# EAGLE design mh (EAGLE 7.4.0)
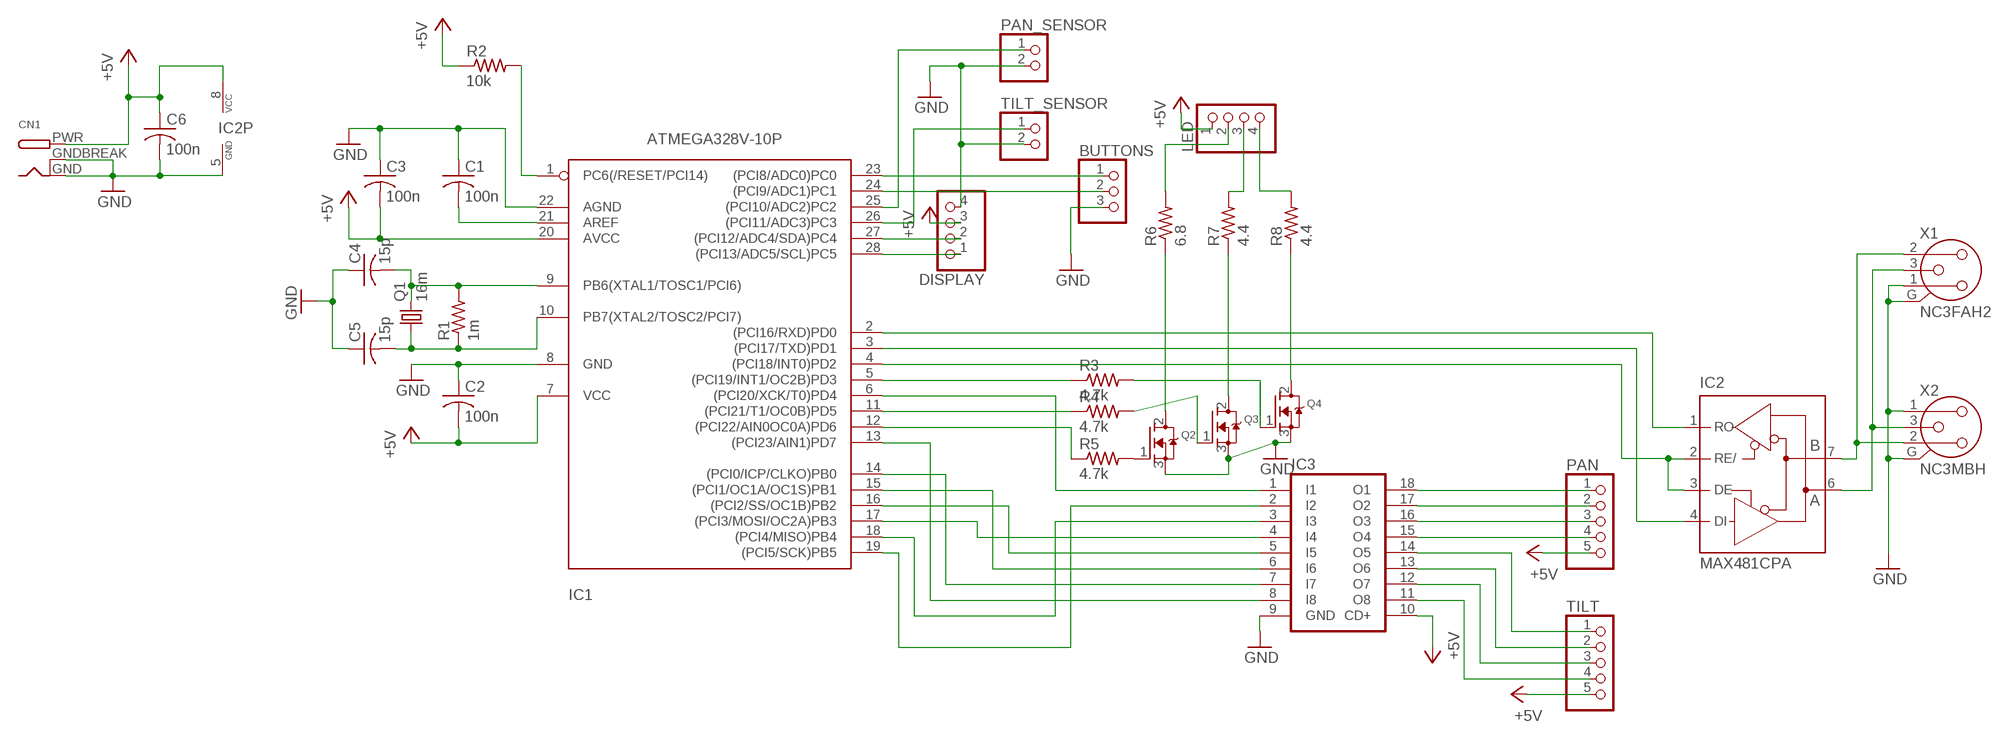
[diagram p0: schematic, sheet 1]

## Parts
BUTTONS  PINHD-1X3  [1X03]
C1  100n  C-US025-024X044  [C025-024X044]
C2  100n  C-US025-024X044  [C025-024X044]
C3  100n  C-US025-024X044  [C025-024X044]
C4  15p  C-US050-024X044  [C050-024X044]
C5  15p  C-US050-024X044  [C050-024X044]
C6  100n  C-US025-024X044  [C025-024X044]
CN1  DCBARRELPTH  [DCJACK_2MM_PTH]
DISPLAY  PINHD-1X4  [1X04]
IC1  ATMEGA328V-10P  [DIL28-3]
IC2  MAX481CPA  [DIL08]
IC3  ULN2803A  [DIL18]
LED  PINHD-1X4  [1X04]
PAN  PINHD-1X5  [1X05]
PAN_SENSOR  PINHD-1X2  [1X02]
Q1  16m  CRYSTALHC49S  [HC49/S]
Q2  MOSFET-NGDS_TO220V  [TO220V]
Q3  MOSFET-NGDS_TO220V  [TO220V]
Q4  MOSFET-NGDS_TO220V  [TO220V]
R1  1m  R-US_0207/10  [0207/10]
R2  10k  R-US_0207/10  [0207/10]
R3  4.7k  R-US_0207/10  [0207/10]
R4  4.7k  R-US_0207/10  [0207/10]
R5  4.7k  R-US_0207/10  [0207/10]
R6  6.8  R-US_0617/17  [0617/17]
R7  4.4  R-US_0617/17  [0617/17]
R8  4.4  R-US_0617/17  [0617/17]
TILT  PINHD-1X5  [1X05]
TILT_SENSOR  PINHD-1X2  [1X02]
X1  NC3FAH2  [NC3FAH2]
X2  NC3MBH  [NC3MBH]

## Nets
+5V: C2.2 C3.2 C6.1 CN1.PWR DISPLAY.3 IC1.7(VCC) IC1.20(AVCC) IC2.8(VCC) IC3.10(CD+) LED.1 PAN.5 R2.1 TILT.5
GND: BUTTONS.3 C1.1 C2.1 C3.1 C4.1 C5.1 C6.2 CN1.GND CN1.GNDBREAK DISPLAY.4 IC1.8(GND) IC1.22(AGND) IC2.5(GND) IC3.9(GND) PAN_SENSOR.2 Q2.3(S) Q3.3(S) Q4.3(S) TILT_SENSOR.2 X1.1 X1.G X2.1 X2.G
N$1: IC1.14((PCI0/ICP/CLKO)PB0) IC3.7(I7)
N$2: C5.2 IC1.10(PB7(XTAL2/TOSC2/PCI7)) Q1.1 R1.1
N$3: C1.2 IC1.21(AREF)
N$4: IC1.5((PCI19/INT1/OC2B)PD3) R3.1
N$5: IC1.1(PC6(/RESET/PCI14)) R2.2
N$6: IC1.11((PCI21/T1/OC0B)PD5) R4.1
N$7: IC1.12((PCI22/AIN0OC0A)PD6) R5.1
N$8: Q2.1(G) R5.2
N$9: Q3.1(G) R4.2
N$10: Q4.1(G) R3.2
N$11: Q2.2(D) R6.1
N$12: Q3.2(D) R7.1
N$14: LED.4 R8.2
N$15: LED.3 R7.2
N$16: LED.2 R6.2
N$18: IC1.19((PCI5/SCK)PB5) IC3.2(I2)
N$19: IC1.18((PCI4/MISO)PB4) IC3.3(I3)
N$20: IC1.17((PCI3/MOSI/OC2A)PB3) IC3.4(I4)
N$21: IC1.16((PCI2/SS/OC1B)PB2) IC3.5(I5)
N$22: IC1.15((PCI1/OC1A/OC1S)PB1) IC3.6(I6)
N$23: IC1.6((PCI20/XCK/T0)PD4) IC3.1(I1)
N$24: IC1.13((PCI23/AIN1)PD7) IC3.8(I8)
N$25: IC3.18(O1) PAN.1
N$26: IC3.17(O2) PAN.2
N$27: IC3.16(O3) PAN.3
N$28: IC3.15(O4) PAN.4
N$29: IC3.14(O5) TILT.1
N$30: IC3.13(O6) TILT.2
N$31: IC1.4((PCI18/INT0)PD2) IC2.2(RE/) IC2.3(DE)
N$32: IC3.12(O7) TILT.3
N$33: IC1.3((PCI17/TXD)PD1) IC2.4(DI)
N$34: IC3.11(O8) TILT.4
N$35: DISPLAY.1 IC1.28((PCI13/ADC5/SCL)PC5)
N$36: DISPLAY.2 IC1.27((PCI12/ADC4/SDA)PC4)
N$37: IC1.2((PCI16/RXD)PD0) IC2.1(RO)
N$38: IC1.25((PCI10/ADC2)PC2) PAN_SENSOR.1
N$39: IC1.26((PCI11/ADC3)PC3) TILT_SENSOR.1
N$40: C4.2 IC1.9(PB6(XTAL1/TOSC1/PCI6)) Q1.2 R1.2
N$41: BUTTONS.1 IC1.23((PCI8/ADC0)PC0)
N$42: IC2.7(B) X1.2 X2.2
N$43: BUTTONS.2 IC1.24((PCI9/ADC1)PC1)
N$44: IC2.6(A) X1.3 X2.3
N$45: Q4.2(D) R8.1

## Library data of the parts
BUTTONS = pinhead:PINHD-1X3: PIN HEADER
C1-C6 = adafruit:C-US: CAPACITOR, American symbol
CN1 = adafruit:DCBARREL: 2.0mm DC Barrel Jack DCJACK_2MM_PTH - Through Hole Jack (4UConnector: 05537)
DISPLAY LED = pinhead:PINHD-1X4: PIN HEADER
IC1 = atmega328:ATMEGA328*P: MICROCONTROLLER 32 kBytes FLASH 2 kBytes SRAM 1 kBytes EEPROM USART 8-channel 10 bit ADC
IC2 = maxim:MAX481CPA: RS485 TRANSEIVER; MPN: MAX481CPA+; OC_FARNELL: unknown; OC_NEWARK: 99K3445
IC3 = uln-udn:ULN2803A: DRIVER ARRAY
PAN TILT = pinhead:PINHD-1X5: PIN HEADER
PAN_SENSOR TILT_SENSOR = pinhead:PINHD-1X2: PIN HEADER
Q1 = adafruit:CRYSTAL: CRYSTAL; OC_FARNELL: 1667008; OC_NEWARK: unknown
Q2-Q4 = adafruit:MOSFET-N: N-Channel Mosfet 2N7002E - 60V 260mA SOT23 [Digikey: 2N7002ET1GOSTR-ND] - REEL BSH103 - 30V 850mA SOT23 [Digikey: 568-5013-1-ND]
R1-R8 = adafruit:R-US_: RESISTOR, American symbol
X1 = con-neutrik_ag:NC3: Neutrik Audio Connector XLR SERIES Stereo 1/4" jack Source: www.neutrik.com/; MPN: NC3FAH2; OC_FARNELL: unknown; OC_NEWARK: 27B4208
X2 = con-neutrik_ag:NC3: Neutrik Audio Connector XLR SERIES Stereo 1/4" jack Source: www.neutrik.com/; MF: NEUTRIK; MPN: NC3MBH; OC_FARNELL: unknown; OC_NEWARK: 91F3470

## Net classes
0 default: width 0.381 mm, drill 0.508 mm, clearance 0.381 mm

## Board
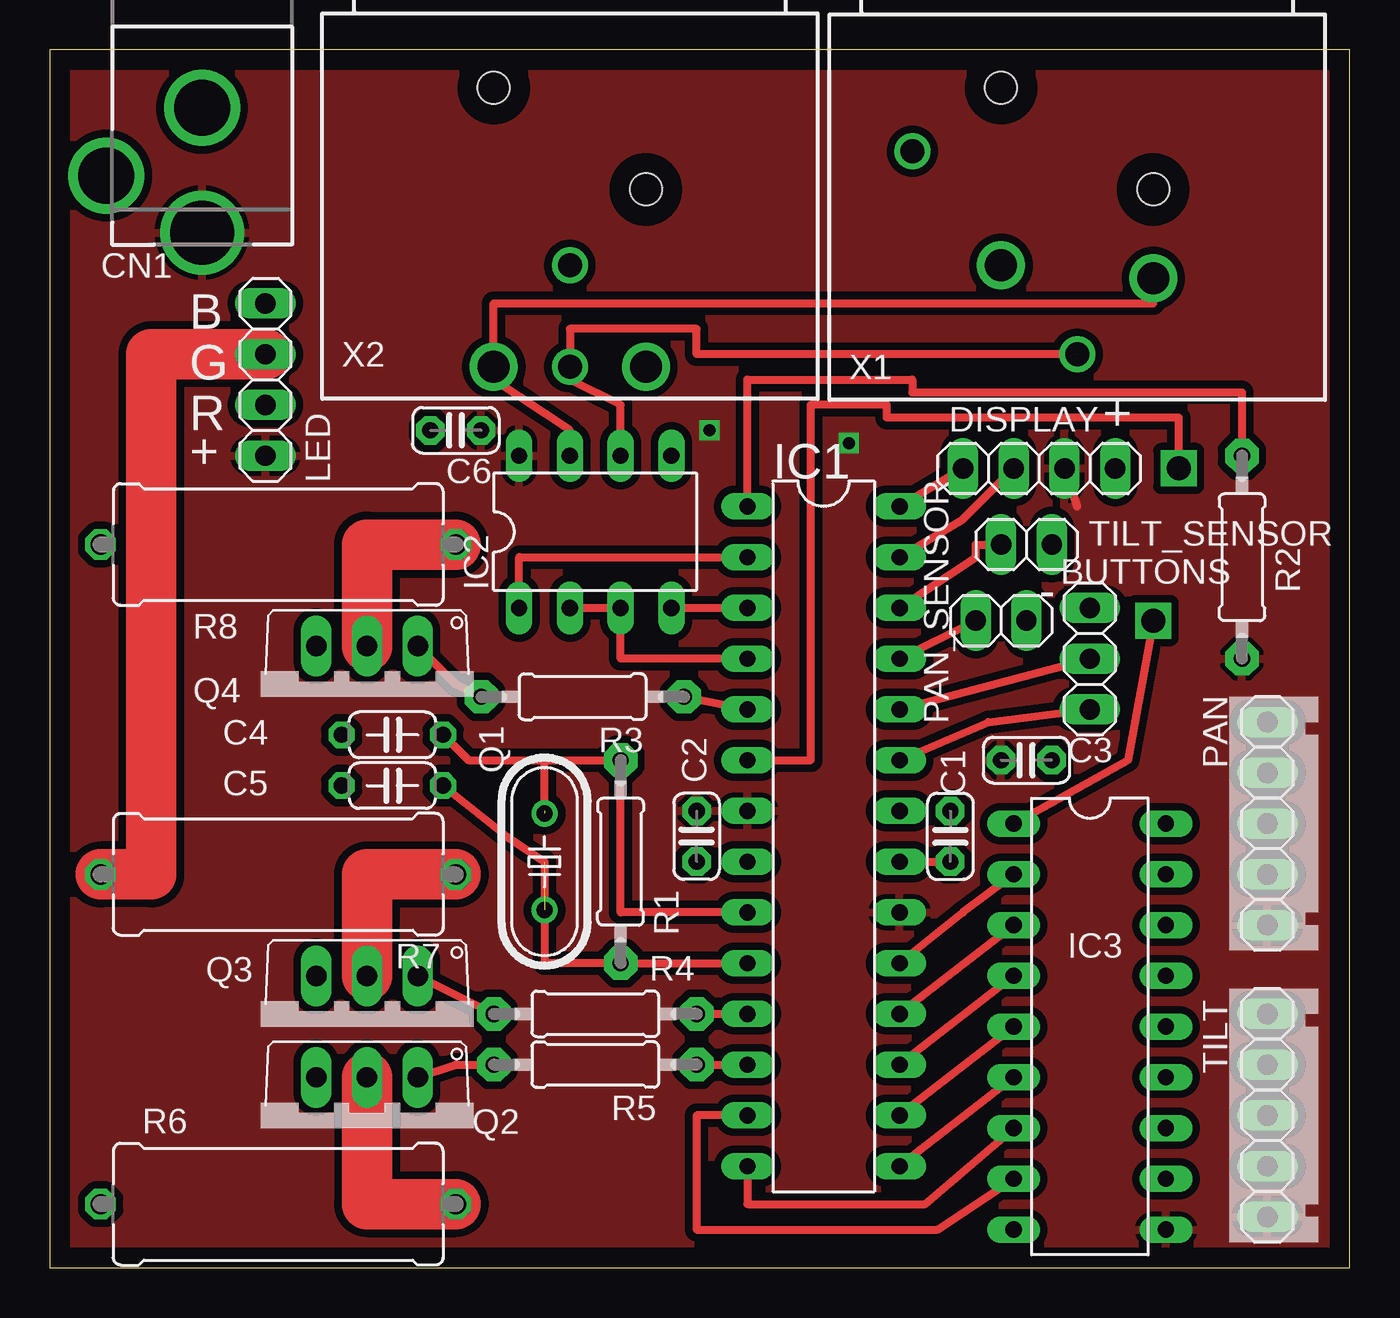
[diagram p1: board, top side]
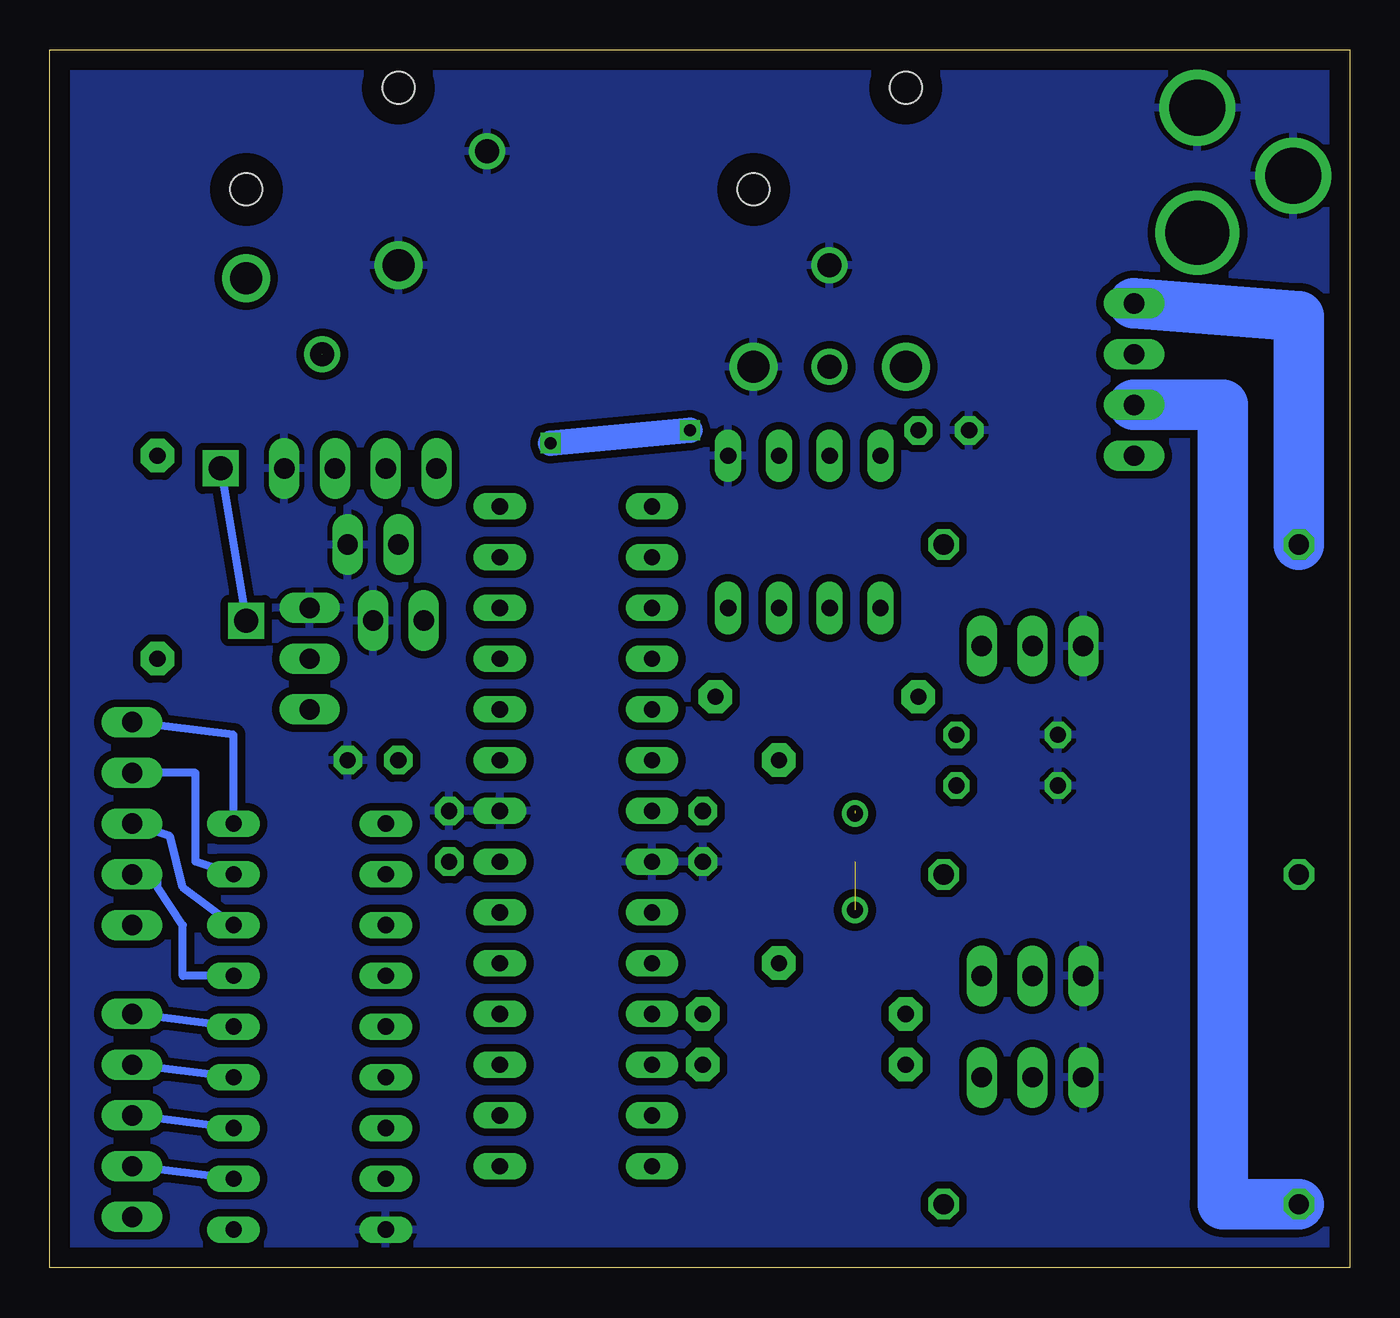
[diagram p2: board, bottom side, seen from below]

Size 65.08 x 60.95 mm. Coordinates in mm from the lower left corner, seen from the top.
Outline: 0,0 65.08,0 65.08,60.95 0,60.95 0,0
Copper layers (1*16): Top 0.035mm / dielectric 1.5mm / Bottom 0.035mm
Design rules "default": minimum track width 10mil, minimum drill 24mil, track to track 8mil, track to pad 8mil, pad to pad 8mil, via to via 8mil, smd to smd 8mil, copper to edge 40mil, drill to drill 8mil, minimum pad ring 10mil, minimum via ring 8mil, stop-mask expansion 4mil, vias tented up to drill 0mil, thermal gap 10mil

### Footprints (pad centres in the part's own frame; a part is rotated, then mirrored left to right if it is on the bottom)
1X03 = drill 1.016 long: 1 -2.54,0; 2 0,0; 3 2.54,0
C025-024X044 = drill 0.813 pad 1.422 octagon: 1 -1.27,0; 2 1.27,0
C050-024X044 = drill 0.813 octagon: 1 -2.54,0; 2 2.54,0
DCJACK_2MM_PTH = drill 2.8: GND 0,7.35; GNDBREAK 4.8,10.75 | drill 3.2: PWR 0,13.6
1X04 = drill 1.016 long: 1 -3.81,0; 2 -1.27,0; 3 1.27,0; 4 3.81,0
DIL28-3 = drill 0.813 long: 1 -16.51,-3.81; 2 -13.97,-3.81; 3 -11.43,-3.81; 4 -8.89,-3.81; 5 -6.35,-3.81; 6 -3.81,-3.81; 7 -1.27,-3.81; 8 1.27,-3.81; 9 3.81,-3.81; 10 6.35,-3.81; 11 8.89,-3.81; 12 11.43,-3.81; 13 13.97,-3.81; 14 16.51,-3.81; 15 16.51,3.81; 16 13.97,3.81; 17 11.43,3.81; 18 8.89,3.81; 19 6.35,3.81; 20 3.81,3.81; 21 1.27,3.81; 22 -1.27,3.81; 23 -3.81,3.81; 24 -6.35,3.81; 25 -8.89,3.81; 26 -11.43,3.81; 27 -13.97,3.81; 28 -16.51,3.81
DIL08 = drill 0.813 long: 1 -3.81,-3.81; 2 -1.27,-3.81; 3 1.27,-3.81; 4 3.81,-3.81; 5 3.81,3.81; 6 1.27,3.81; 7 -1.27,3.81; 8 -3.81,3.81
DIL18 = drill 0.813 long: 1 -10.16,-3.81; 2 -7.62,-3.81; 3 -5.08,-3.81; 4 -2.54,-3.81; 5 0,-3.81; 6 2.54,-3.81; 7 5.08,-3.81; 8 7.62,-3.81; 9 10.16,-3.81; 10 10.16,3.81; 11 7.62,3.81; 12 5.08,3.81; 13 2.54,3.81; 14 0,3.81; 15 -2.54,3.81; 16 -5.08,3.81; 17 -7.62,3.81; 18 -10.16,3.81
1X05 = drill 1.016 long: 1 -5.08,0; 2 -2.54,0; 3 0,0; 4 2.54,0; 5 5.08,0
1X02 = drill 1.016 long: 1 -1.27,0; 2 1.27,0
HC49/S = drill 0.813: 1 -2.413,0; 2 2.413,0
TO220V = drill 1.016 long: 1 -2.54,-2.54; 2 0,-2.54; 3 2.54,-2.54
0207/10 = drill 0.813 pad 1.676 octagon: 1 -5.08,0; 2 5.08,0
0617/17 = drill 1.016 octagon: 1 -8.89,0; 2 8.89,0
NC3FAH2 = drill 1.6: 1 -3.81,0.635; 2 3.81,0 | drill 1.2: 3 0,-3.815; G -8.25,6.355 | hole 1.6: -3.81,9.525; 3.81,4.445
NC3MBH = drill 1.6: 1 3.81,0; 2 -3.81,0 | drill 1.2: 3 0,0; G 0,5.08 | hole 1.6: -3.81,13.97; 3.81,8.89

### Placement (x,y rotation side)
BUTTONS  52.07,30.48 90 top
C1  45.09,21.59 270 top
C2  32.38,21.59 90 top
C3  48.89,25.4 180 top
C4  17.15,26.67 0 top
C5  17.15,24.13 0 top
C6  20.32,41.91 180 top
CN1  7.62,65.41 180 top
DISPLAY  49.53,40 0 top
IC1  38.73,21.59 270 top
IC2  27.31,36.83 0 top
IC3  52.07,12.06 270 top
LED  10.79,44.45 90 top
PAN  60.96,22.22 270 top
PAN_SENSOR  47.62,32.39 0 top
Q1  24.77,20.32 90 top
Q2  15.88,6.98 180 top
Q3  15.88,12.06 180 top
Q4  15.88,28.57 180 top
R1  28.58,20.32 90 top
R2  59.69,35.56 90 top
R3  26.67,28.57 180 top
R4  27.31,12.7 180 top
R5  27.31,10.16 180 top
R6  11.43,3.18 180 top
R7  11.43,19.68 180 top
R8  11.43,36.19 180 top
TILT  60.96,7.62 270 top
TILT_SENSOR  48.89,36.19 0 top
X1  51.43,49.53 0 top
X2  26.04,45.09 0 top

### Tracks (layer width: path | path; a pad name or v marks a point on that pad's centre or on a via)
+5V  (via drill 0.6)
  Top 0.406: 51.43,38.1 DISPLAY.3
  Bottom 1.27: v33.02,41.91 v40,41.28
  pour Top: 0,60.96 64.77,60.96 64.77,0 0,0
GND
  pour Bottom: 0,60.96 0,0 64.77,0 64.77,60.96
N$1
  Top 0.406: IC1.14 34.92,3.18 43.81,3.18 IC3.7
N$2  (1 unrouted)
  Top 0.406: IC1.10 R1.1 24.77,15.24 24.77,20.32 22.86,21.59 C5.2
N$3
  Top 0.406: IC1.21 C1.2
N$4
  Top 0.406: R3.1 IC1.5
N$5
  Top 0.406: IC1.1 34.92,44.45 43.18,44.45 43.18,43.81 59.69,43.81 R2.2
N$6
  Top 0.406: R4.1 IC1.11
N$7
  Top 0.406: R5.1 IC1.12
N$8
  Top 0.406: Q2.1 20.32,10.16 R5.2
N$9
  Top 0.406: Q3.1 R4.2
N$10
  Top 0.406: Q4.1 20.32,29.21 R3.2
N$11
  Top 2.54: Q2.2 15.88,3.18 R6.1
N$12
  Top 2.54: Q3.2 15.88,19.68 R7.1
N$14
  Bottom 2.54: LED.4 2.54,47.62 R8.2
N$15
  Top 2.54: LED.3 5.08,45.72 5.08,19.68 R7.2
N$16
  Bottom 2.54: LED.2 6.35,43.18 6.35,3.18 R6.2
N$18
  Top 0.406: IC1.19 45.72,17.78 IC3.2
N$19
  Top 0.406: IC1.18 IC3.3
N$20
  Top 0.406: IC1.17 IC3.4
N$21
  Top 0.406: IC1.16 IC3.5
N$22
  Top 0.406: IC1.15 IC3.6
N$23  (via drill 1.2)
  Top 0.406: IC1.6 38.1,25.4 38.1,43.18 41.91,43.18 41.91,42.55 56.52,42.55 v56.52,40 | IC3.1 53.98,25.4 v55.24,32.39
  Bottom 0.406: v56.52,40 v55.24,32.39
N$24
  Top 0.406: IC1.13 32.38,7.62 32.38,1.9 44.45,1.9 IC3.8
N$25
  Bottom 0.406: IC3.18 55.88,26.67 PAN.1
N$26
  Bottom 0.406: IC3.17 57.78,20.32 57.78,24.76 PAN.2
N$27
  Bottom 0.406: IC3.16 58.42,19.05 59.05,21.59 PAN.3
N$28
  Bottom 0.406: IC3.15 58.42,14.61 58.42,17.14 59.69,19.05 59.69,19.68 PAN.4
N$29
  Bottom 0.406: IC3.14 TILT.1
N$30
  Bottom 0.406: IC3.13 TILT.2
N$31
  Top 0.406: IC2.2 IC2.3 28.58,30.48 IC1.4
N$32
  Bottom 0.406: IC3.12 TILT.3
N$33
  Top 0.406: IC2.4 IC1.3
N$34
  Bottom 0.406: IC3.11 TILT.4
N$35
  Top 0.406: IC1.28 DISPLAY.1
N$36
  Top 0.406: IC1.27 45.72,37.47 DISPLAY.2
N$37
  Top 0.406: IC2.1 23.5,35.56 IC1.2
N$38
  Top 0.406: IC1.25 PAN_SENSOR.1
N$39
  Top 0.406: IC1.26 46.35,35.56 46.35,36.19 TILT_SENSOR.1
N$40  (1 unrouted)
  Top 0.406: IC1.9 28.58,17.78 R1.2 24.77,25.4 | C4.2 20.96,25.4 24.77,25.4 | 24.77,22.86 24.77,25.4
N$41
  Top 0.406: IC1.23 46.99,27.3 BUTTONS.1
N$42
  Top 0.406: IC2.7 26.04,41.91 22.23,44.45 X2.2 22.23,48.26 55.24,48.26 X1.2
N$43
  Top 0.406: IC1.24 BUTTONS.2
N$44  (1 unrouted)
  Top 0.406: X1.3 32.38,45.72 32.38,46.99 26.04,46.99 X2.3 26.04,44.45 28.58,43.18 IC2.6
N$45
  Top 2.54: Q4.2 15.88,36.19 R8.1

### Text on the board
tPlace: B | G | R | +
tNames: + | -